# EAGLE design main (EAGLE 6.0)
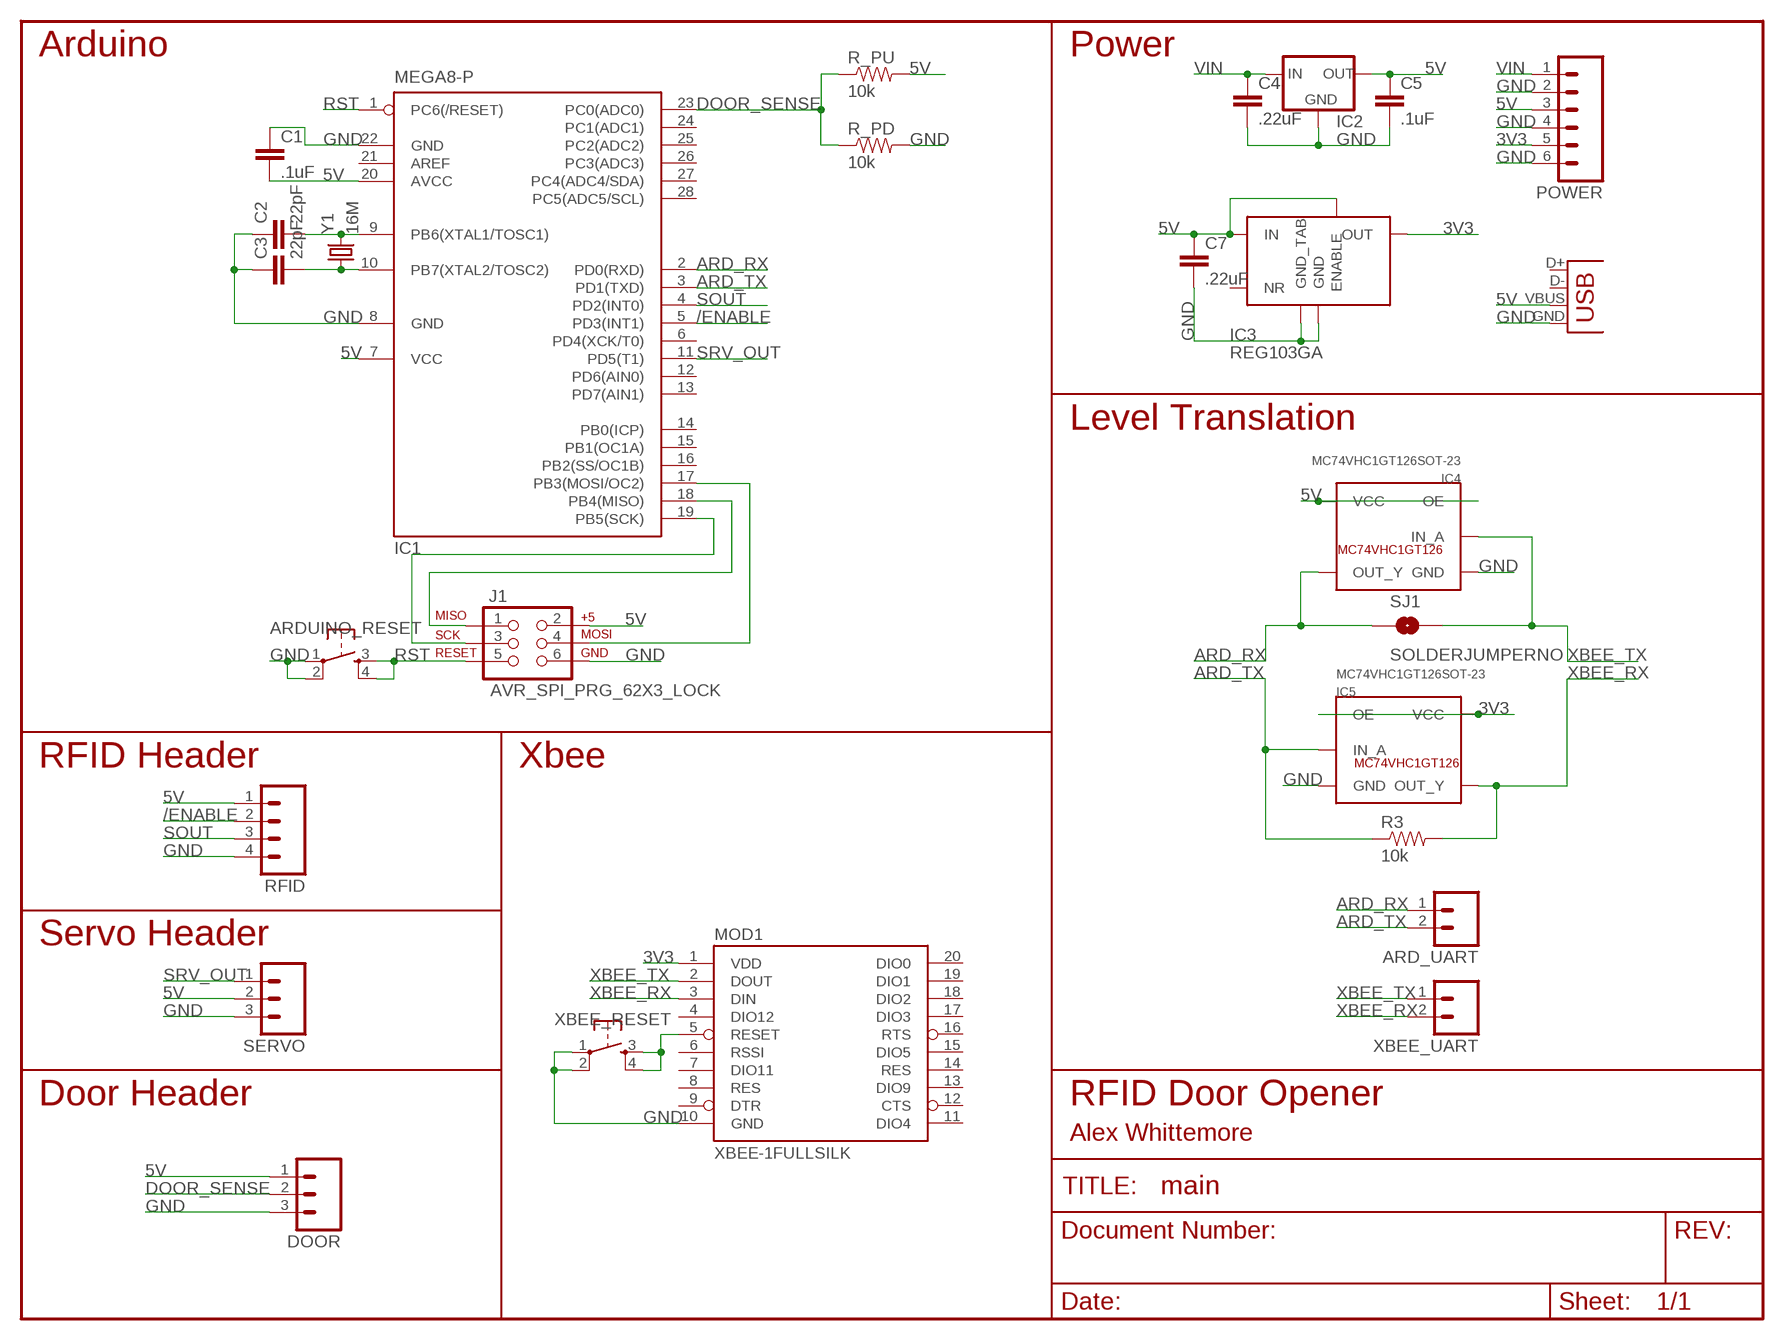
[diagram p0: schematic, sheet 1]

## Parts
ARD_UART  M02LOCK_LONGPADS  [1X02_LOCK_LONGPADS]
ARDUINO_RESET  TAC_SWITCHPTH  [TACTILE-PTH]
C1  .1uF  CAP0805  [0805]
C2  22pF  CAP0805  [0805]
C3  22pF  CAP0805  [0805]
C4  .22uF  CAP0805  [0805]
C5  .1uF  CAP0805  [0805]
C7  .22uF  CAP0805  [0805]
DOOR  M03LOCK  [1X03_LOCK]
IC1  MEGA8-P  [DIL28-3]
IC2  V_REG_78XX-TO-220  [TO-220-ALT]
IC3  REG103GA  [SOT223-5]
IC4  MC74VHC1GT126SOT-23  [SOT23-5L]
IC5  MC74VHC1GT126SOT-23  [SOT23-5L]
J1  AVR_SPI_PRG_62X3_LOCK  [2X3_LOCK]
MOD1  XBEE-1FULLSILK  [XBEE]
POWER  M06LOCK  [1X06_LOCK]
R3  10k  RESISTOR0805-RES  [0805]
R_PD  10k  RESISTOR0805-RES  [0805]
R_PU  10k  RESISTOR0805-RES  [0805]
RFID  M04LOCK_LONGPADS  [1X04_LOCK_LONGPADS]
SERVO  M03LOCK  [1X03_LOCK]
SJ1  SOLDERJUMPERNO  [SJ_2S-NO]
X1  USB-SMD-NS  [USB-MINIB-NOSTOP]
XBEE_RESET  TAC_SWITCHPTH  [TACTILE-PTH]
XBEE_UART  M02LOCK_LONGPADS  [1X02_LOCK_LONGPADS]
Y1  16M  CRYSTALSMD  [HC49UP]

## Nets
3V3: IC3.2(OUT) IC5.1(OE) IC5.5(VCC) MOD1.1(VDD) POWER.5
5V: C1.2 C5.1 C7.1 DOOR.1 IC1.7(VCC) IC1.20(AVCC) IC2.OUT IC3.1(IN) IC3.5(ENABLE) IC4.1(OE) IC4.5(VCC) J1.2 POWER.3 R_PU.2 RFID.1 SERVO.2 X1.VBUS
/ENABLE: IC1.5(PD3(INT1)) RFID.2
ARD_RX: ARD_UART.1 IC1.2(PD0(RXD)) IC4.4(OUT_Y) SJ1.1
ARD_TX: ARD_UART.2 IC1.3(PD1(TXD)) IC5.2(IN_A) R3.1
DOOR_SENSE: DOOR.2 IC1.23(PC0(ADC0)) R_PD.1 R_PU.1
GND: ARDUINO_RESET.1 ARDUINO_RESET.2 C1.1 C2.1 C3.1 C4.2 C5.2 C7.2 DOOR.3 IC1.8(GND) IC1.22(GND) IC2.GND IC3.3(GND) IC3.TAB(GND_TAB) IC4.3(GND) IC5.3(GND) J1.6 MOD1.10(GND) POWER.2 POWER.4 POWER.6 R_PD.2 RFID.4 SERVO.3 X1.GND XBEE_RESET.1 XBEE_RESET.2
ISP_MISO: IC1.18(PB4(MISO)) J1.1
ISP_MOSI: IC1.17(PB3(MOSI/OC2)) J1.4
ISP_SCK: IC1.19(PB5(SCK)) J1.3
N$1: C2.2 IC1.9(PB6(XTAL1/TOSC1)) Y1.2
N$2: C3.2 IC1.10(PB7(XTAL2/TOSC2)) Y1.1
RST: ARDUINO_RESET.3 ARDUINO_RESET.4 IC1.1(PC6(/RESET)) J1.5
SOUT: IC1.4(PD2(INT0)) RFID.3
SRV_OUT: IC1.11(PD5(T1)) SERVO.1
VIN: C4.1 IC2.IN POWER.1
XBEE_RST: MOD1.5(RESET) XBEE_RESET.3 XBEE_RESET.4
XBEE_RX: IC5.4(OUT_Y) MOD1.3(DIN) R3.2 XBEE_UART.2
XBEE_TX: IC4.2(IN_A) MOD1.2(DOUT) SJ1.2 XBEE_UART.1
Unconnected: IC1.6(PD4(XCK/T0)) IC1.12(PD6(AIN0)) IC1.13(PD7(AIN1)) IC1.14(PB0(ICP)) IC1.15(PB1(OC1A)) IC1.16(PB2(SS/OC1B)) IC1.21(AREF) IC1.24(PC1(ADC1)) IC1.25(PC2(ADC2)) IC1.26(PC3(ADC3)) IC1.27(PC4(ADC4/SDA)) IC1.28(PC5(ADC5/SCL)) IC3.4(NR) MOD1.4(DIO12) MOD1.6(RSSI) MOD1.7(DIO11) MOD1.8(RES) MOD1.9(DTR) MOD1.11(DIO4) MOD1.12(CTS) MOD1.13(DIO9) MOD1.14(RES) MOD1.15(DIO5) MOD1.16(RTS) MOD1.17(DIO3) MOD1.18(DIO2) MOD1.19(DIO1) MOD1.20(DIO0) X1.D+ X1.D-

## Notes on the sheet
- Arduino | Power
- Level Translation
- RFID Header | Xbee
- Servo Header
- Door Header | RFID Door Opener
- Alex Whittemore

## Library data of the parts
ARD_UART XBEE_UART = SparkFun:M02: Header 2 Standard 2-pin 0.1" header. Use with straight break away headers (SKU : PRT-00116), right angle break away headers (PRT-00553), swiss pins (PRT-00743), machine pins (PRT-00117), and female headers (PRT-00115). Molex polarized connector foot print use with SKU : PRT-08233 with associated crimp pins and housings.
ARDUINO_RESET XBEE_RESET = SparkFun:TAC_SWITCH: Momentary Switch Button commonly used for reset or general input. Spark Fun Electronics SKU : COM-00097
C1-C5 C7 = SparkFun:CAP: Capacitor Standard 0603 ceramic capacitor, and 0.1" leaded capacitor.
DOOR SERVO = SparkFun:M03: Header 3 Standard 3-pin 0.1" header. Use with straight break away headers (SKU : PRT-00116), right angle break away headers (PRT-00553), swiss pins (PRT-00743), machine pins (PRT-00117), and female headers (PRT-00115). Molex polarized connector foot print use with SKU : PRT-08232 with associated crimp pins and housings.
IC1 = atmel:MEGA8-P: MICROCONTROLLER 8 Kbytes FLASH, 1 kbytes SRAM, 512 bytes EEPROM, USART, 4-channel 10 bit ADC, 2-channel 8 bit ADC Pin compatible with Atmega48, ATMega88, ATMega168 Source: avr.lbr; OC_FARNELL: unknown; OC_NEWARK: unknown
IC2 = SparkFun:V_REG_78XX: Voltage Regulator Standard 7805 5V regulator. IGO (Input Ground Output). Spark Fun Electronics SKU : COM-00107
IC3 = alexwhittemore-eagle:REG103
IC4 IC5 = alexwhittemore-eagle:MC74VHC1GT126
J1 = SparkFun:AVR_SPI_PRG_6: AVR ISP 6 Pin This is the reduced ISP connector for AVR programming. Common on Arduino. This footprint will take up less PCB space and can be used with a 10-pin to 6-pin adapter such as SKU: BOB-08508
MOD1 = alexwhittemore-eagle:XBEE-1
POWER = SparkFun:M06: Header 6 Standard 6-pin 0.1" header. Use with straight break away headers (SKU : PRT-00116), right angle break away headers (PRT-00553), swiss pins (PRT-00743), machine pins (PRT-00117), and female headers (PRT-00115). Molex polarized connector foot print use with SKU : PRT-08094 with associated crimp pins and housings. NOTES ON THE VARIANTS LOCK and LOCK_LONGPADS... This footprint was designed to help hold the alignment of a through-hole component (i.e. 6-pin header) while soldering it into place. You may notice that each hole has been shifted either up or down by 0.005 of an inch from it's more standard position (which is a perfectly straight line). This slight alteration caused the pins (the squares in the middle) to touch the edges of the holes. Because they are alternating, it causes a "brace" to hold the component in place. 0.005 has proven to be the perfect amount of "off-center" position when using our standard breakaway headers. Although looks a little odd when you look at the bare footprint, once you have a header in there, the alteration is very hard to notice. Also, if you push a header all the way into place, it is covered up entirely on the bottom side. This idea of altering the position of holes to aid alignment will be further integrated into the Sparkfun Library for other footprints. It can help hold any component with 3 or more connection pins.
R3 R_PD R_PU = SparkFun:RESISTOR: Resistor Basic schematic elements and footprints for 0603, 1206, and PTH resistors.
RFID = SparkFun:M04: Header 4 Standard 4-pin 0.1" header. Use with straight break away headers (SKU : PRT-00116), right angle break away headers (PRT-00553), swiss pins (PRT-00743), machine pins (PRT-00117), and female headers (PRT-00115). Molex polarized connector foot print use with SKU : PRT-08231 with associated crimp pins and housings. 1MM SMD Version SKU: PRT-10208
SJ1 = SparkFun:SOLDERJUMPER: Solder Jumper Standard SMD solder jumper. Used to automate production. Two varients : Normally Open and Normally Closed are the same, but have different paste layers. NC will have a large amount of paste and should jumper during reflow.
X1 = SparkFun:USB: USB Connectors USB-B-PTH is fully proven SKU : PRT-00139 USB-miniB is fully proven SKU : PRT-00587 USB-A-PCB is untested. USB-A-H is throughly reviewed, but untested. Spark Fun Electronics SKU : PRT-00437 USB-B-SMT is throughly reviewed, but untested. Needs silkscreen touching up. USB-A-S has not been used/tested USB-MB-H has not been used/tested
Y1 = SparkFun:CRYSTAL: Crystals Various standard crystals. Proven footprints. Spark Fun Electronics SKU : COM-00534

## Board
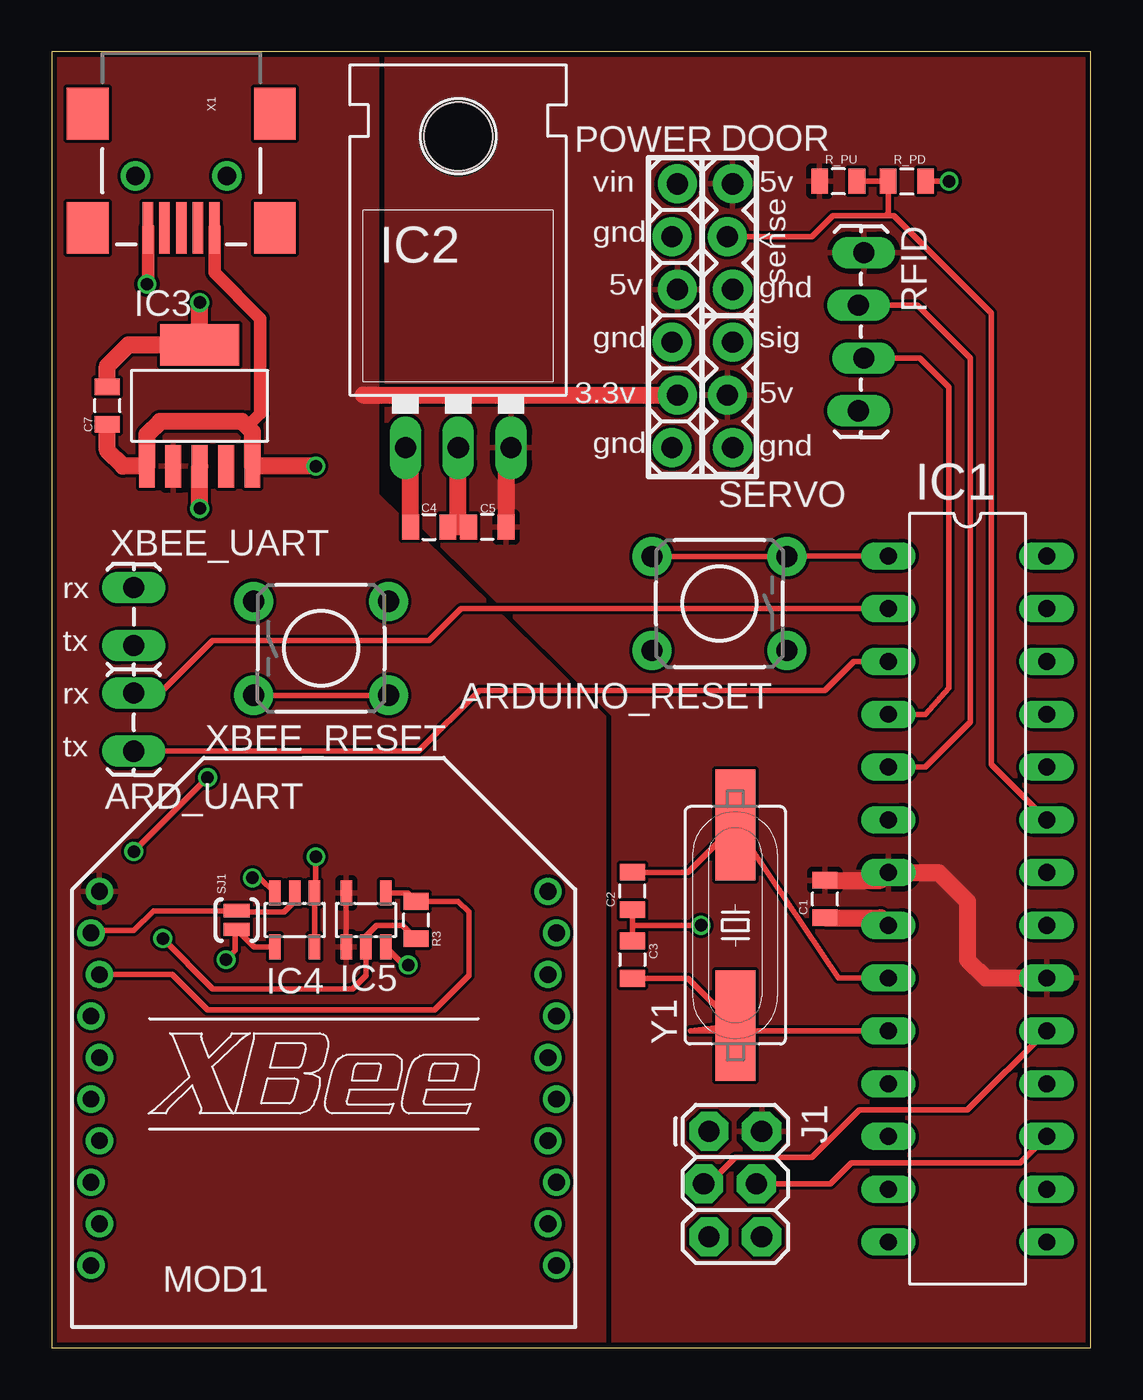
[diagram p1: board, top side]
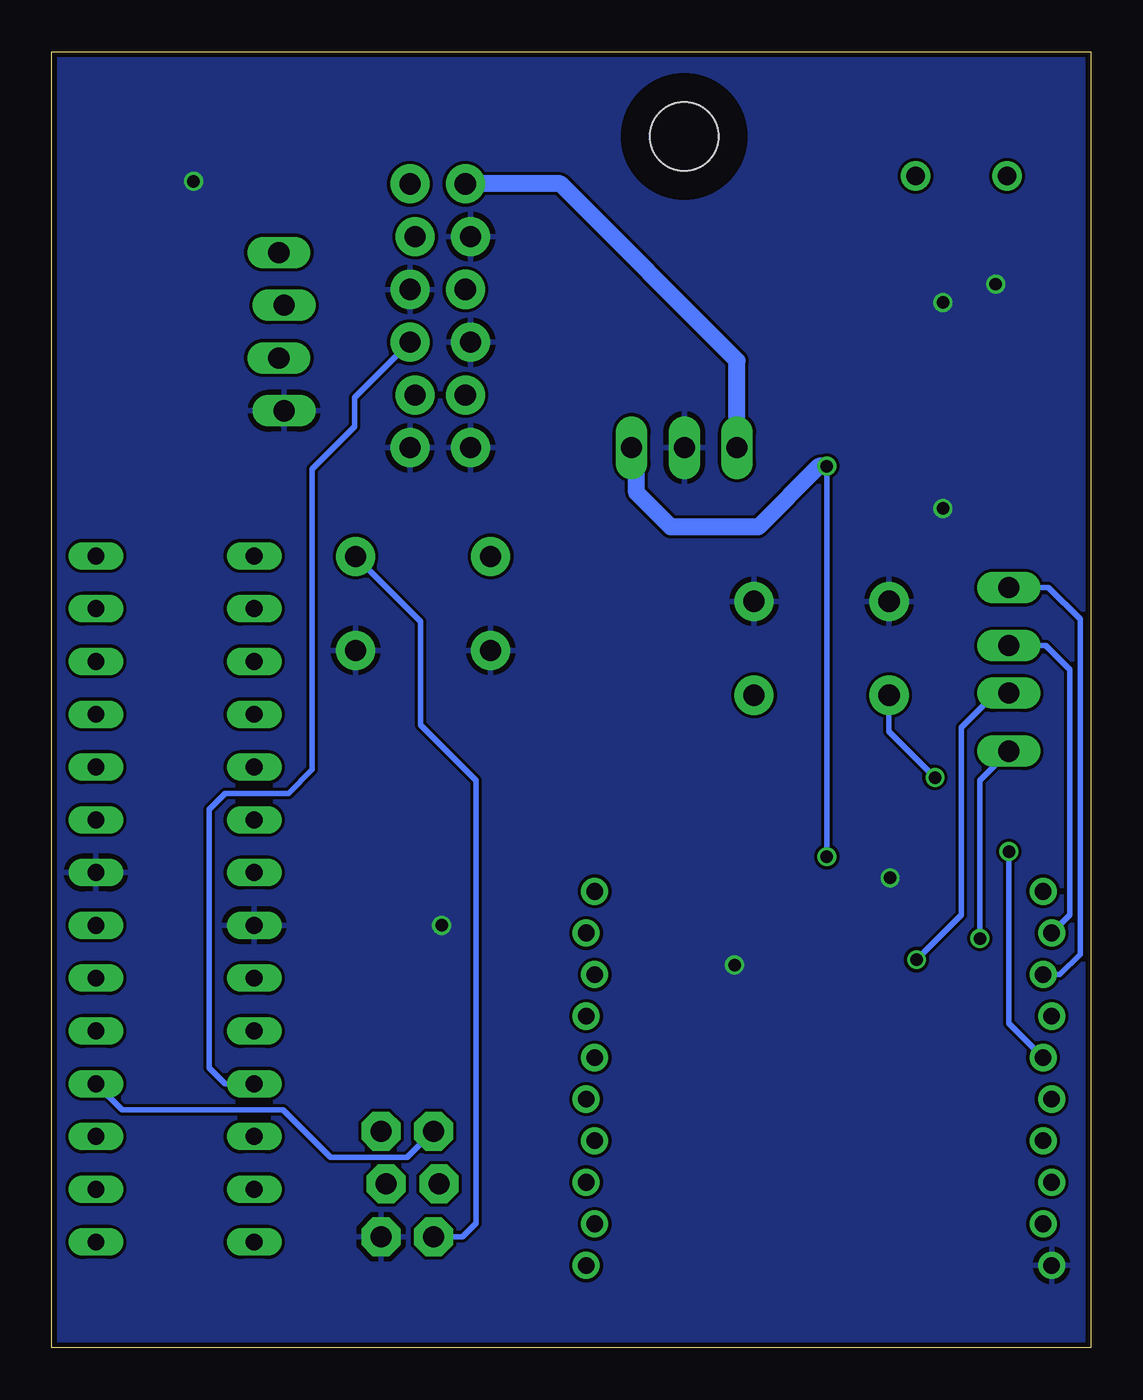
[diagram p2: board, bottom side, seen from below]

Size 50 x 62.36 mm. Coordinates in mm from the lower left corner, seen from the top.
Outline: 0,0 50,0 50,62.36 0,62.36 0,0
Copper layers (1*16): Top 0.035mm / dielectric 1.5mm / Bottom 0.035mm
Design rules: minimum track width 6mil, minimum drill 12mil, track to track 6mil, track to pad 6mil, pad to pad 6mil, via to via 6mil, smd to smd 0mil, copper to edge 10mil, drill to drill 10mil, minimum pad ring 10mil, minimum via ring 6mil, stop-mask expansion 2mil, vias tented up to drill 100mil, thermal gap 10mil

### Footprints (pad centres in the part's own frame; a part is rotated, then mirrored left to right if it is on the bottom)
1X02_LOCK_LONGPADS = drill 1.016 long: 1 -0.127,0; 2 2.667,0
TACTILE-PTH = drill 1.016 pad 1.88: 1 -3.251,2.261; 2 3.251,2.261; 3 -3.251,-2.261; 4 3.251,-2.261
0805 = smd 0.8 x 1.2: 1 -0.9,0; 2 0.9,0
1X03_LOCK = drill 1.016 pad 1.88: 1 0,0.127; 2 2.54,-0.127; 3 5.08,0.127
DIL28-3 = drill 0.813 long: 1 -16.51,-3.81; 2 -13.97,-3.81; 3 -11.43,-3.81; 4 -8.89,-3.81; 5 -6.35,-3.81; 6 -3.81,-3.81; 7 -1.27,-3.81; 8 1.27,-3.81; 9 3.81,-3.81; 10 6.35,-3.81; 11 8.89,-3.81; 12 11.43,-3.81; 13 13.97,-3.81; 14 16.51,-3.81; 15 16.51,3.81; 16 13.97,3.81; 17 11.43,3.81; 18 8.89,3.81; 19 6.35,3.81; 20 3.81,3.81; 21 1.27,3.81; 22 -1.27,3.81; 23 -3.81,3.81; 24 -6.35,3.81; 25 -8.89,3.81; 26 -11.43,3.81; 27 -13.97,3.81; 28 -16.51,3.81
TO-220-ALT = drill 1.016 long: GND 0,-3.81; IN -2.54,-3.81; OUT 2.54,-3.81 | hole 3.302: 0,11.176
SOT223-5 = smd 0.762 x 2.032: 1 -2.54,-2.54; 2 -1.27,-2.54; 3 0,-2.54; 4 1.27,-2.54; 5 2.54,-2.54 | smd 3.81 x 2.007: TAB 0,3.302
SOT23-5L = smd 0.55 x 1.2: 1 -0.95,-1.3; 2 0,-1.3; 3 0.95,-1.3; 4 0.95,1.3; 5 -0.95,1.3
2X3_LOCK = drill 1.016 pad 1.88 octagon: 1 0,0; 2 0,2.54; 3 2.54,-0.254; 4 2.54,2.286; 5 5.08,0; 6 5.08,2.54
XBEE = drill 0.8 pad 1.27: 1 -10.797,9; 2 -11.203,7; 3 -10.797,5; 4 -11.203,3; 5 -10.797,1; 6 -11.203,-1; 7 -10.797,-3; 8 -11.203,-5; 9 -10.797,-7; 10 -11.203,-9; 11 11.203,-9; 12 10.797,-7; 13 11.203,-5; 14 10.797,-3; 15 11.203,-1; 16 10.797,1; 17 11.203,3; 18 10.797,5; 19 11.203,7; 20 10.797,9
1X06_LOCK = drill 1.016 pad 1.88: 1 0,0; 2 2.54,-0.254; 3 5.08,0; 4 7.62,-0.254; 5 10.16,0; 6 12.7,-0.254
1X04_LOCK_LONGPADS = drill 1.016 long: 1 0,0; 2 2.54,-0.254; 3 5.08,0; 4 7.62,-0.254
SJ_2S-NO = smd 0.635 x 1.27: 1 -0.45,0; 2 0.45,0
USB-MINIB-NOSTOP = smd 2.5 x 0.5: D+ 2.5,0; D- 2.5,0.8; GND 2.5,-1.6; ID 2.5,-0.8; VBUS 2.5,1.6 | smd 2.5 x 2: G1 -3,-4.5; G2 -3,4.5; G3 2.5,4.5; G4 2.5,-4.5 | drill 0.9 pad 0.8: H1 0,2.2 | drill 0.9 pad 0.787: H2 0,-2.2
HC49UP = smd 5.334 x 1.93: 1 -4.826,0; 2 4.826,0

### Placement (x,y rotation side)
ARD_UART  3.94,31.37 270 top
ARDUINO_RESET  32.13,35.81 180 top
C1  37.21,21.59 90 top
C2  27.94,21.97 90 top
C3  27.94,18.67 270 top
C4  18.16,39.5 0 top
C5  20.95,39.5 180 top
C7  2.67,45.34 90 top
DOOR  32.64,56.01 270 top
IC1  44.07,21.59 270 top
IC2  19.56,47.12 0 top
IC3  7.11,44.96 0 top
IC4  11.68,20.57 180 top
IC5  15.11,20.57 0 top
J1  31.62,10.41 270 top
MOD1  13.08,12.95 0 top
POWER  30.1,56.01 270 top
R3  17.53,20.57 90 top
R_PD  41.15,56.13 0 top
R_PU  37.85,56.13 180 top
RFID  39.08,52.7 270 top
SERVO  32.64,48.39 270 top
SJ1  8.89,20.57 90 top
X1  6.22,56.39 270 top
XBEE_RESET  12.95,33.66 0 top
XBEE_UART  3.94,33.91 90 top
Y1  32.89,20.32 90 top

### Tracks (layer width: path | path; a pad name or v marks a point on that pad's centre or on a via)
3V3
  Top 0.254: IC5.1 IC5.5
  Top 0.813: 14.99,45.85 POWER.5
  pour Top: -0.64,-5.08 -0.51,83.95 15.62,84.07 15.62,41.02 26.54,30.35 26.54,-5.08
5V  (via drill 0.6)
  Top 0.254: IC4.5 IC4.1 12.7,21.94 v12.7,23.62
  Top 0.61: X1.VBUS 7.82,51.74 10.03,49.53 10.03,44.96 9.4,44.32
  Top 0.813: IC2.OUT 21.86,43.31 C5.1 | C7.1 2.67,43.18 3.43,42.42 IC3.1 4.57,43.94 5.21,44.58 9.14,44.58 9.4,44.32 9.65,44.07 IC3.5 v12.7,42.42 | IC1.20 44.96,17.78 44.07,18.67 44.07,21.46 42.67,22.86 IC1.7 39.89,22.49 C1.2
  Bottom 0.254: v12.7,23.62 v12.7,42.42
  Bottom 0.813: v12.7,42.42 13.08,42.42 16,39.5 20.2,39.5 21.86,41.15 21.86,43.06 IC2.OUT
  pour Top: 106.43,84.33 106.43,-5.08 27.05,-5.08 27.05,30.48 16.13,41.27 16.13,84.33
/ENABLE
  Top 0.254: RFID.2 41.66,50.16 44.2,47.62 44.2,30.1 42.04,27.94 IC1.5
ARD_RX  (via drill 0.6)
  Top 0.254: IC4.4 9.74,19.27 SJ1.1 8.82,20.19 8.82,19.11 v8.38,18.67 | IC1.2 19.68,35.56 18.16,34.04 7.75,34.04 5.21,31.5 ARD_UART.1
  Bottom 0.254: ARD_UART.1 4.57,31.5 6.22,29.84 6.22,20.83 v8.38,18.67
ARD_TX  (via drill 0.6)
  Top 0.254: R3.1 16.88,20.32 15.62,20.32 15.11,19.81 IC5.2 15.11,17.91 14.48,17.27 7.75,17.27 v5.33,19.68 | IC1.3 38.61,33.02 37.21,31.62 20.57,31.62 17.65,28.7 ARD_UART.2
  Bottom 0.254: v5.33,19.68 5.33,27.3 ARD_UART.2
DOOR_SENSE
  Top 0.254: IC1.23 45.21,28.07 45.21,49.78 40.51,54.48 40.13,54.48 | 40.13,54.48 37.59,54.48 36.58,53.47 DOOR.2 | R_PU.1 R_PD.1 40.25,54.6 40.13,54.48
GND  (via drill 0.6)
  Top 0.254: C3.1 C2.1 27.94,20.32 v31.24,20.32 | IC4.3 10,22.61 v9.65,22.61 | IC5.3 16.92,18.41 v17.14,18.41 | DOOR.3 32.77,50.92 | R_PD.2 v43.18,56.13
  Top 0.61: v4.57,51.18 4.62,51.18 X1.GND
  Top 0.813: 19.56,39.5 C4.2 | 19.56,39.5 IC2.GND | C5.2 19.56,39.5 | C7.2 2.67,47.24 3.68,48.26 IC3.TAB v7.11,50.29 | C1.1 39.89,20.69 IC1.8 | v7.11,40.39 IC3.3
  pour Bottom: -1.14,84.84 107.06,84.84 107.06,-5.71 -1.14,-5.71
ISP_MISO
  Bottom 0.254: J1.1 32.89,9.14 36.58,9.14 38.86,11.43 46.61,11.43 IC1.18
ISP_MOSI
  Top 0.254: J1.4 37.47,7.87 38.48,8.89 46.61,8.89 IC1.17
ISP_SCK
  Top 0.254: J1.3 31.62,7.87 32.89,9.14 36.58,9.14 38.86,11.43 44.07,11.43 IC1.19
N$1
  Top 0.254: C2.2 30.62,22.87 Y1.2 37.85,17.78 IC1.9
N$2
  Top 0.254: C3.2 30.62,17.77 Y1.1 30.73,15.24 IC1.10
RST
  Top 0.254: IC1.1 35.41,38.1 ARDUINO_RESET.3 ARDUINO_RESET.4
  Bottom 0.254: J1.5 30.23,5.33 29.59,5.97 29.59,27.3 32.26,29.97 32.26,34.95 ARDUINO_RESET.3
SOUT
  Top 0.254: RFID.3 41.78,47.62 43.18,46.23 43.18,31.75 42.04,30.48 IC1.4
SRV_OUT
  Bottom 0.254: IC1.11 41.66,12.7 42.42,13.46 42.42,25.91 41.66,26.67 38.61,26.67 37.47,27.81 37.47,42.29 35.43,44.32 35.43,45.72 SERVO.1
VIN
  Top 0.813: IC2.IN 17.26,43.31 C4.1
  Bottom 0.813: POWER.1 25.53,56.01 17.02,47.5 IC2.IN
XBEE_RST  (via drill 0.6)
  Top 0.254: XBEE_RESET.3 XBEE_RESET.4 | v3.94,23.88 v7.49,27.43
  Bottom 0.254: MOD1.5 3.94,15.61 v3.94,23.88 | XBEE_RESET.3 9.7,29.64 v7.49,27.43
XBEE_RX
  Top 0.254: 16.06,22.11 IC5.4 17.13,21.87 R3.2 19.56,21.46 20.07,20.95 20.07,17.91 18.41,16.26 7.49,16.26 5.79,17.95 MOD1.3
  Bottom 0.254: XBEE_UART.2 2.03,36.58 0.51,35.05 0.51,18.92 1.48,17.95 MOD1.3
XBEE_TX
  Top 0.254: IC4.2 11.68,21.46 11.18,20.95 8.96,20.95 SJ1.2 4.89,21.02 3.94,20.07 1.99,20.07 MOD1.2
  Bottom 0.254: XBEE_UART.1 2.16,33.78 1.02,32.64 1.02,20.82 MOD1.2

### Text on the board
tPlace: vin | 5v | gnd | ^ | 5v | gnd | sense | gnd | sig | 3.3v | 5v | gnd | gnd | rx | tx | rx | tx